# Altium schematic sheet DEMO.SchDoc
size A4
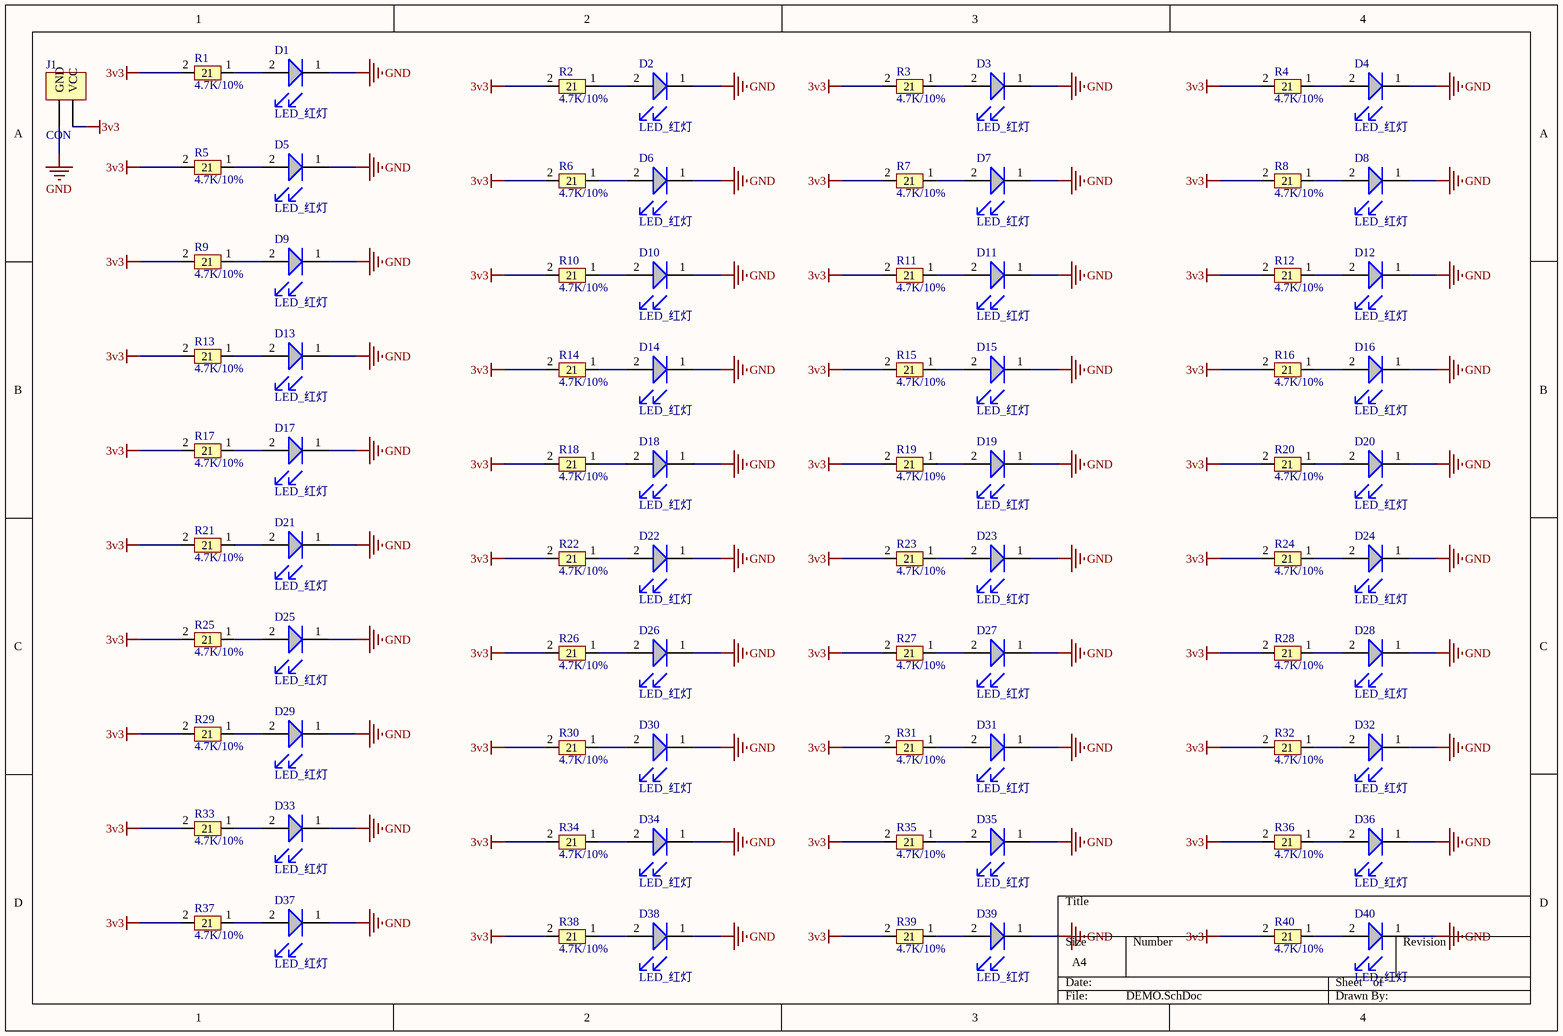
[diagram p0: DEMO.SchDoc]

## Parts
D1  LED_红灯  [LED_0603]
D2  LED_红灯  [LED_0603]
D3  LED_红灯  [LED_0603]
D4  LED_红灯  [LED_0603]
D5  LED_红灯  [LED_0603]
D6  LED_红灯  [LED_0603]
D7  LED_红灯  [LED_0603]
D8  LED_红灯  [LED_0603]
D9  LED_红灯  [LED_0603]
D10  LED_红灯  [LED_0603]
D11  LED_红灯  [LED_0603]
D12  LED_红灯  [LED_0603]
D13  LED_红灯  [LED_0603]
D14  LED_红灯  [LED_0603]
D15  LED_红灯  [LED_0603]
D16  LED_红灯  [LED_0603]
D17  LED_红灯  [LED_0603]
D18  LED_红灯  [LED_0603]
D19  LED_红灯  [LED_0603]
D20  LED_红灯  [LED_0603]
D21  LED_红灯  [LED_0603]
D22  LED_红灯  [LED_0603]
D23  LED_红灯  [LED_0603]
D24  LED_红灯  [LED_0603]
D25  LED_红灯  [LED_0603]
D26  LED_红灯  [LED_0603]
D27  LED_红灯  [LED_0603]
D28  LED_红灯  [LED_0603]
D29  LED_红灯  [LED_0603]
D30  LED_红灯  [LED_0603]
D31  LED_红灯  [LED_0603]
D32  LED_红灯  [LED_0603]
D33  LED_红灯  [LED_0603]
D34  LED_红灯  [LED_0603]
D35  LED_红灯  [LED_0603]
D36  LED_红灯  [LED_0603]
D37  LED_红灯  [LED_0603]
D38  LED_红灯  [LED_0603]
D39  LED_红灯  [LED_0603]
D40  LED_红灯  [LED_0603]
J1  CON  [CON]
R1  4.7K/10%  [RES_0603]
R2  4.7K/10%  [RES_0603]
R3  4.7K/10%  [RES_0603]
R4  4.7K/10%  [RES_0603]
R5  4.7K/10%  [RES_0603]
R6  4.7K/10%  [RES_0603]
R7  4.7K/10%  [RES_0603]
R8  4.7K/10%  [RES_0603]
R9  4.7K/10%  [RES_0603]
R10  4.7K/10%  [RES_0603]
R11  4.7K/10%  [RES_0603]
R12  4.7K/10%  [RES_0603]
R13  4.7K/10%  [RES_0603]
R14  4.7K/10%  [RES_0603]
R15  4.7K/10%  [RES_0603]
R16  4.7K/10%  [RES_0603]
R17  4.7K/10%  [RES_0603]
R18  4.7K/10%  [RES_0603]
R19  4.7K/10%  [RES_0603]
R20  4.7K/10%  [RES_0603]
R21  4.7K/10%  [RES_0603]
R22  4.7K/10%  [RES_0603]
R23  4.7K/10%  [RES_0603]
R24  4.7K/10%  [RES_0603]
R25  4.7K/10%  [RES_0603]
R26  4.7K/10%  [RES_0603]
R27  4.7K/10%  [RES_0603]
R28  4.7K/10%  [RES_0603]
R29  4.7K/10%  [RES_0603]
R30  4.7K/10%  [RES_0603]
R31  4.7K/10%  [RES_0603]
R32  4.7K/10%  [RES_0603]
R33  4.7K/10%  [RES_0603]
R34  4.7K/10%  [RES_0603]
R35  4.7K/10%  [RES_0603]
R36  4.7K/10%  [RES_0603]
R37  4.7K/10%  [RES_0603]
R38  4.7K/10%  [RES_0603]
R39  4.7K/10%  [RES_0603]
R40  4.7K/10%  [RES_0603]

## Nets
3v3: J1.1(VCC) R1.2 R2.2 R3.2 R4.2 R5.2 R6.2 R7.2 R8.2 R9.2 R10.2 R11.2 R12.2 R13.2 R14.2 R15.2 R16.2 R17.2 R18.2 R19.2 R20.2 R21.2 R22.2 R23.2 R24.2 R25.2 R26.2 R27.2 R28.2 R29.2 R30.2 R31.2 R32.2 R33.2 R34.2 R35.2 R36.2 R37.2 R38.2 R39.2 R40.2
GND: D1.1 D2.1 D3.1 D4.1 D5.1 D6.1 D7.1 D8.1 D9.1 D10.1 D11.1 D12.1 D13.1 D14.1 D15.1 D16.1 D17.1 D18.1 D19.1 D20.1 D21.1 D22.1 D23.1 D24.1 D25.1 D26.1 D27.1 D28.1 D29.1 D30.1 D31.1 D32.1 D33.1 D34.1 D35.1 D36.1 D37.1 D38.1 D39.1 D40.1 J1.2(GND)
NetD1_2: D1.2 R1.1
NetD2_2: D2.2 R2.1
NetD3_2: D3.2 R3.1
NetD4_2: D4.2 R4.1
NetD5_2: D5.2 R5.1
NetD6_2: D6.2 R6.1
NetD7_2: D7.2 R7.1
NetD8_2: D8.2 R8.1
NetD9_2: D9.2 R9.1
NetD10_2: D10.2 R10.1
NetD11_2: D11.2 R11.1
NetD12_2: D12.2 R12.1
NetD13_2: D13.2 R13.1
NetD14_2: D14.2 R14.1
NetD15_2: D15.2 R15.1
NetD16_2: D16.2 R16.1
NetD17_2: D17.2 R17.1
NetD18_2: D18.2 R18.1
NetD19_2: D19.2 R19.1
NetD20_2: D20.2 R20.1
NetD21_2: D21.2 R21.1
NetD22_2: D22.2 R22.1
NetD23_2: D23.2 R23.1
NetD24_2: D24.2 R24.1
NetD25_2: D25.2 R25.1
NetD26_2: D26.2 R26.1
NetD27_2: D27.2 R27.1
NetD28_2: D28.2 R28.1
NetD29_2: D29.2 R29.1
NetD30_2: D30.2 R30.1
NetD31_2: D31.2 R31.1
NetD32_2: D32.2 R32.1
NetD33_2: D33.2 R33.1
NetD34_2: D34.2 R34.1
NetD35_2: D35.2 R35.1
NetD36_2: D36.2 R36.1
NetD37_2: D37.2 R37.1
NetD38_2: D38.2 R38.1
NetD39_2: D39.2 R39.1
NetD40_2: D40.2 R40.1

## Library data of the parts
D1-D40 = LED
R1-R40 = RES